# EAGLE design board_c-01 (EAGLE 8.1.1)
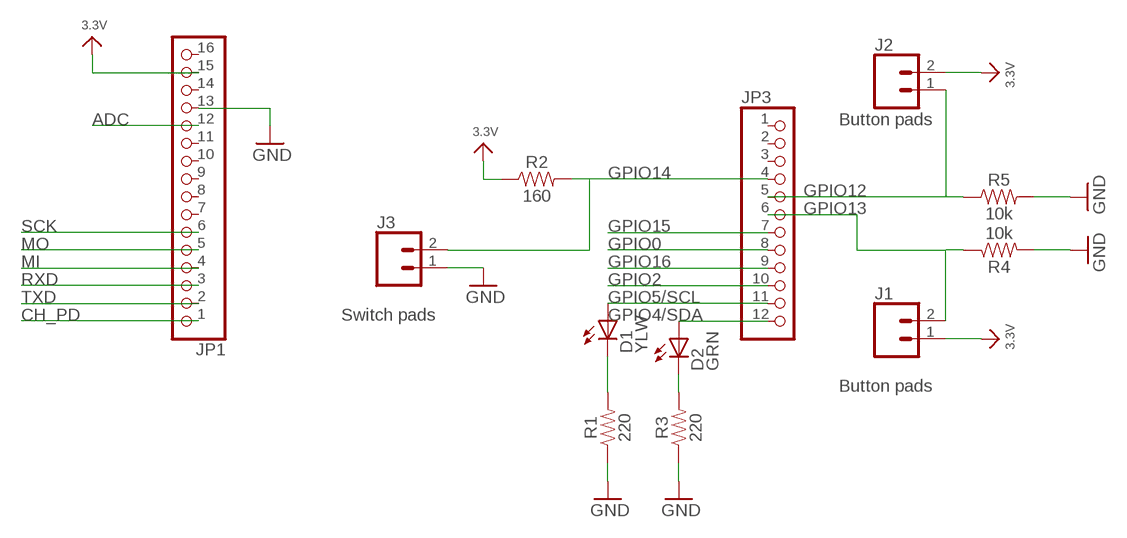
[diagram p0: schematic, sheet 1]

## Parts
D1  YLW  LED3MM  [LED3MM]
D2  GRN  LED3MM  [LED3MM]
J1  CONN_02LOCK_LONGPADS  [1X02_LOCK_LONGPADS]
J2  CONN_02LOCK_LONGPADS  [1X02_LOCK_LONGPADS]
J3  CONN_02LOCK_LONGPADS  [1X02_LOCK_LONGPADS]
JP1  HEADER-1X16ROUND  [1X16_ROUND]
JP3  HEADER-1X12  [1X12_ROUND]
R1  220  1KOHM-HORIZ-1/4W-1%  [AXIAL-0.3]
R2  160  1KOHM-HORIZ-1/4W-1%  [AXIAL-0.3]
R3  220  1KOHM-HORIZ-1/4W-1%  [AXIAL-0.3]
R4  10k  1KOHM-HORIZ-1/4W-1%  [AXIAL-0.3]
R5  10k  1KOHM-HORIZ-1/4W-1%  [AXIAL-0.3]

## Nets
3.3V: J1.1 J2.2 JP1.15 R2.P$1
ADC: JP1.12
CH_PD: JP1.1
GND: J3.1 JP1.13 R1.P$1 R3.P$1 R4.P$2 R5.P$2
GPIO0: JP3.8
GPIO2: JP3.10
GPIO4/SDA: D2.A JP3.12
GPIO5/SCL: D1.A JP3.11
GPIO12: J2.1 JP3.5 R5.P$1
GPIO13: J1.2 JP3.6 R4.P$1
GPIO14: J3.2 JP3.4 R2.P$2
GPIO15: JP3.7
GPIO16: JP3.9
MI: JP1.4
MO: JP1.5
N$1: D1.K(C) R1.P$2
N$2: D2.K(C) R3.P$2
RXD: JP1.3
SCK: JP1.6
TXD: JP1.2
Unconnected: JP1.7 JP1.8 JP1.9 JP1.10 JP1.11 JP1.14 JP1.16 JP3.1 JP3.2 JP3.3

## Notes on the sheet
- Button pads
- Switch pads
- Button pads

## Library data of the parts
D1 D2 = adafruit:LED: LED OSRAM: - CHIPLED LG R971, LG N971, LY N971, LG Q971, LY Q971, LO R971, LY R971 LH N974, LH R974 LS Q976, LO Q976, LY Q976 LO Q996 - Hyper CHIPLED LW Q18S LB Q993, LB Q99A, LB R99A - SideLED LS A670, LO A670, LY A670, LG A670, LP A670 LB A673, LV A673, LT A673, LW A673 LH A674 LY A675 LS A676, LA A676, LO A676, LY A676, LW A676 LS A679, LY A679, LG A679 - Hyper Micro SIDELED® LS Y876, LA Y876, LO Y876, LY Y876 LT Y87S - SmartLED LW L88C, LW L88S LB L89C, LB L89S, LG L890 LS L89K, LO L89K, LY L89K LS L896, LA L896, LO L896, LY L896 - TOPLED LS T670, LO T670, LY T670, LG T670, LP T670 LSG T670, LSP T670, LSY T670, LOP T670, LYG T670 LG T671, LOG T671, LSG T671 LB T673, LV T673, LT T673, LW T673 LH T674 LS T676, LA T676, LO T676, LY T676, LB T676, LH T676, LSB T676, LW T676 LB T67C, LV T67C, LT T67C, LS T67K, LO T67K, LY T67K, LW E67C LS E67B, LA E67B, LO E67B, LY E67B, LB E67C, LV E67C, LT E67C LW T67C LS T679, LY T679, LG T679 LS T770, LO T770, LY T770, LG T770, LP T770 LB T773, LV T773, LT T773, LW T773 LH T774 LS E675, LA E675, LY E675, LS T675 LS T776, LA T776, LO T776, LY T776, LB T776 LHGB T686 LT T68C, LB T68C - Hyper Mini TOPLED® LB M676 - Mini TOPLED Santana® LG M470 LS M47K, LO M47K, LY M47K Source: http://www.osram.convergy.de/
J1-J3 = SparkFun-Connectors:CONN_02: Multi connection point. Often used as Generic Header-pin footprint for 0.1 inch spaced/style header connections On any of the 0.1 inch spaced packages, you can populate with these: Break Away Headers - Straight <https://www.sparkfun.com/products/116> (PRT-00116) Break Away Male Headers - Right Angle <https://www.sparkfun.com/products/553> (PRT-00553) Female Headers <https://www.sparkfun.com/products/115> (PRT-00115) Break Away Headers - Machine Pin <https://www.sparkfun.com/products/117> (PRT-00117) Break Away Female Headers - Swiss Machine Pin <https://www.sparkfun.com/products/743> (PRT-00743) For SCREWTERMINALS and SPRING TERMINALS visit here: Screw Terimnals on SparkFun.com <https://www.sparkfun.com/search/results?term=Screw+Terminals> (5mm/3.5mm/2.54mm spacing) This device is also useful as a general connection point to wire up your design to another part of your project. Our various solder wires solder well into these plated through hole pads. Hook-Up Wire - Assortment (Stranded, 22 AWG) <https://www.sparkfun.com/products/11375> (PRT-11375) Hook-Up Wire - Assortment (Solid Core, 22 AWG) <https://www.sparkfun.com/products/11367> (PRT-11367) View the entire wire category on our website here <https://www.sparkfun.com/categories/141> Special notes: Molex polarized connector foot print use with: PRT-08233 with associated crimp pins and housings. 2.54_SCREWTERM for use with PRT-10571. 3.5mm Screw Terminal footprints for PRT-08084 5mm Screw Terminal footprints for use with PRT-08432
JP1 = microbuilder:HEADER-1X16: PIN HEADER
JP3 = microbuilder:HEADER-1X12
R1-R5 = SparkFun-Resistors:1KOHM: 1kΩ resistor A resistor is a passive two-terminal electrical component that implements electrical resistance as a circuit element. Resistors act to reduce current flow, and, at the same time, act to lower voltage levels within circuits. - Wikipedia; PROD_ID: RES-12182; VALUE: 1k

## Board
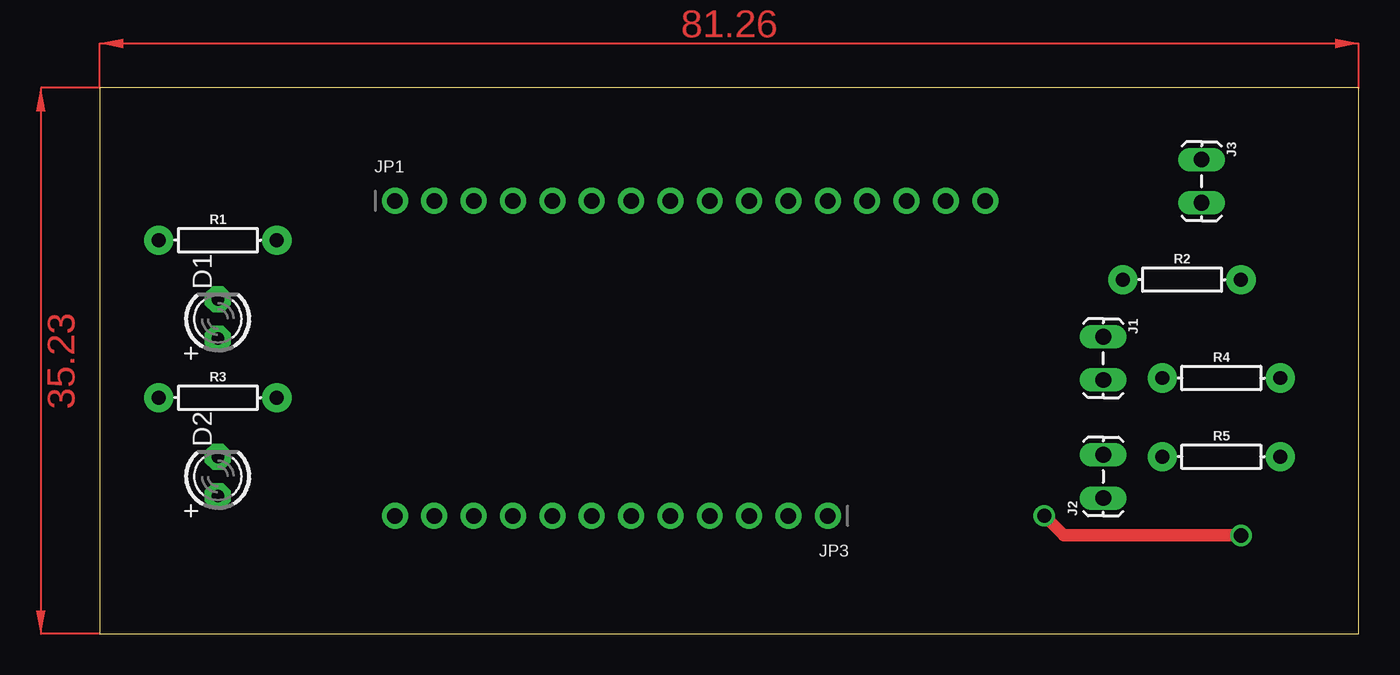
[diagram p1: board, top side]
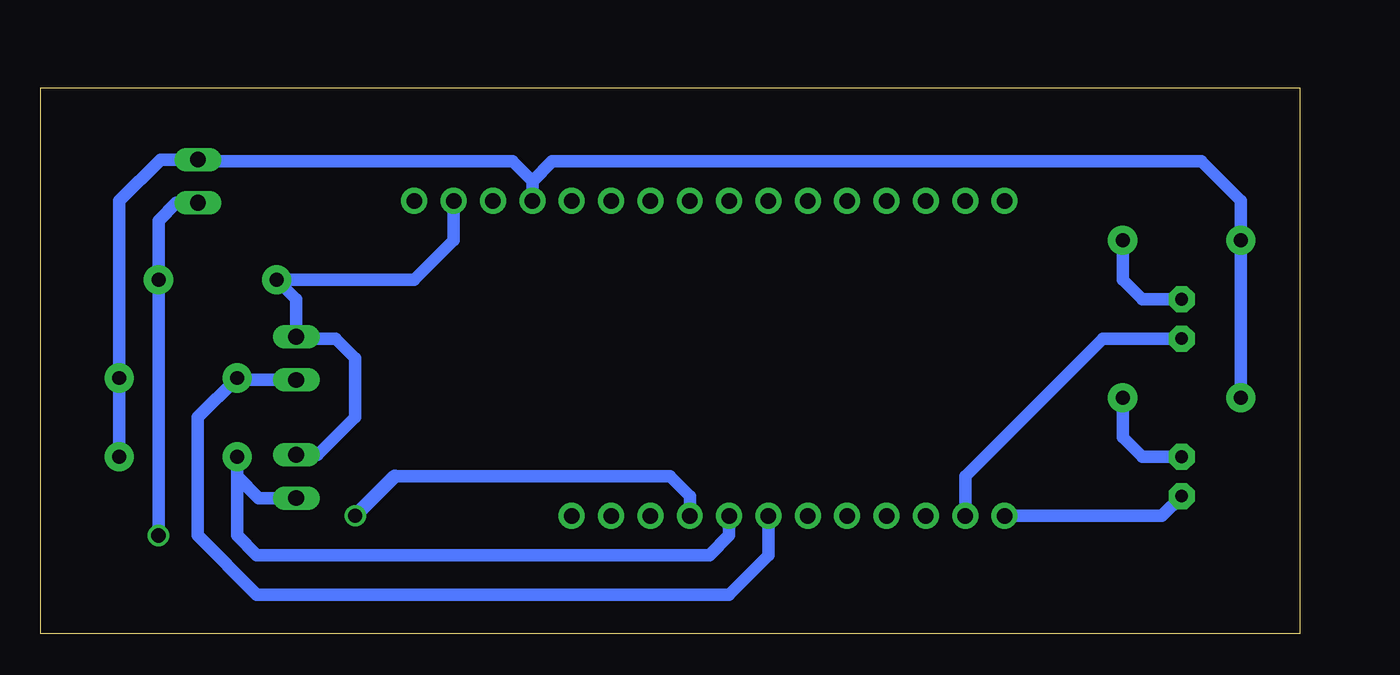
[diagram p2: board, bottom side, seen from below]

Size 81.26 x 35.23 mm. Coordinates in mm from the lower left corner, seen from the top.
Outline: 0,0 81.26,0 81.26,35.23 0,35.23 0,0
Copper layers (1*16): Top 0.035mm / dielectric 1.5mm / Bottom 0.035mm
Design rules "default": minimum track width 10mil, minimum drill 24mil, track to track 8mil, track to pad 8mil, pad to pad 8mil, via to via 8mil, smd to smd 8mil, copper to edge 40mil, drill to drill 8mil, minimum pad ring 10mil, minimum via ring 8mil, stop-mask expansion 4mil, vias tented up to drill 0mil, thermal gap 10mil

### Footprints (pad centres in the part's own frame; a part is rotated, then mirrored left to right if it is on the bottom)
LED3MM = drill 0.813 pad 1.676 octagon: A -1.27,0; K 1.27,0
1X02_LOCK_LONGPADS = drill 1.016 long: 1 -0.127,0; 2 2.667,0
1X16_ROUND = drill 1 pad 1.676: 1 -19.05,0; 2 -16.51,0; 3 -13.97,0; 4 -11.43,0; 5 -8.89,0; 6 -6.35,0; 7 -3.81,0; 8 -1.27,0; 9 1.27,0; 10 3.81,0; 11 6.35,0; 12 8.89,0; 13 11.43,0; 14 13.97,0; 15 16.51,0; 16 19.05,0
1X12_ROUND = drill 1 pad 1.676: 1 -13.97,0; 2 -11.43,0; 3 -8.89,0; 4 -6.35,0; 5 -3.81,0; 6 -1.27,0; 7 1.27,0; 8 3.81,0; 9 6.35,0; 10 8.89,0; 11 11.43,0; 12 13.97,0
AXIAL-0.3 = drill 0.9 pad 1.88: P$1 -3.81,0; P$2 3.81,0

### Placement (x,y rotation side)
D1  7.62,20.32 90 top
D2  7.62,10.16 90 top
J1  64.77,19.05 270 top
J2  64.77,8.89 90 top
J3  71.12,30.48 270 top
JP1  38.1,27.94 0 top
JP3  33.02,7.62 180 top
R1  7.62,25.4 0 top
R2  69.85,22.86 0 top
R3  7.62,15.24 0 top
R4  72.39,16.51 0 top
R5  72.39,11.43 0 top

### Tracks (layer width: path | path; a pad name or v marks a point on that pad's centre or on a via)
3.3V
  Bottom 0.813: J2.2 63.37,11.56 60.96,13.97 60.96,17.78 62.23,19.05 64.64,19.05 J1.1 64.77,21.59 R2.P$1 57.15,22.86 54.61,25.4 JP1.15
GND
  Bottom 0.813: R3.P$1 R1.P$1 3.81,27.94 6.35,30.48 48.26,30.48 49.53,29.21 | 49.53,29.21 50.8,30.48 70.99,30.48 J3.1 73.53,30.61 76.2,27.94 R4.P$2 R5.P$2 | JP1.13 49.53,29.21
GPIO4/SDA
  Bottom 0.813: JP3.12 8.89,7.62 D2.A
GPIO5/SCL
  Bottom 0.813: JP3.11 21.59,10.16 12.7,19.05 D1.A
GPIO12
  Bottom 0.813: JP3.5 36.83,6.35 38.1,5.08 67.31,5.08 68.58,6.35 68.58,10.16 | J2.1 67.18,8.76 68.58,10.16 | 68.58,10.16 R5.P$1
GPIO13
  Bottom 0.813: JP3.6 34.29,5.08 36.83,2.54 67.31,2.54 71.12,6.35 71.12,13.97 R4.P$1 68.45,16.38 J1.2
GPIO14  (via drill 0.91)
  Top 0.813: v73.66,6.35 62.23,6.35 v60.96,7.62
  Bottom 0.813: J3.2 72.52,27.81 73.66,26.67 R2.P$2 v73.66,6.35 | 58.42,10.16 40.64,10.16 39.37,8.89 JP3.4
  Bottom 0.914: v60.96,7.62 58.42,10.16
N$1
  Bottom 0.813: D1.K 10.16,21.59 11.43,22.86 R1.P$2
N$2
  Bottom 0.813: R3.P$2 11.43,12.7 10.16,11.43 D2.K
(copper drawn outside any net)
  shapes: Top area x2